# EAGLE design WeMos-WLED-V01-008 (EAGLE 9.5.1)
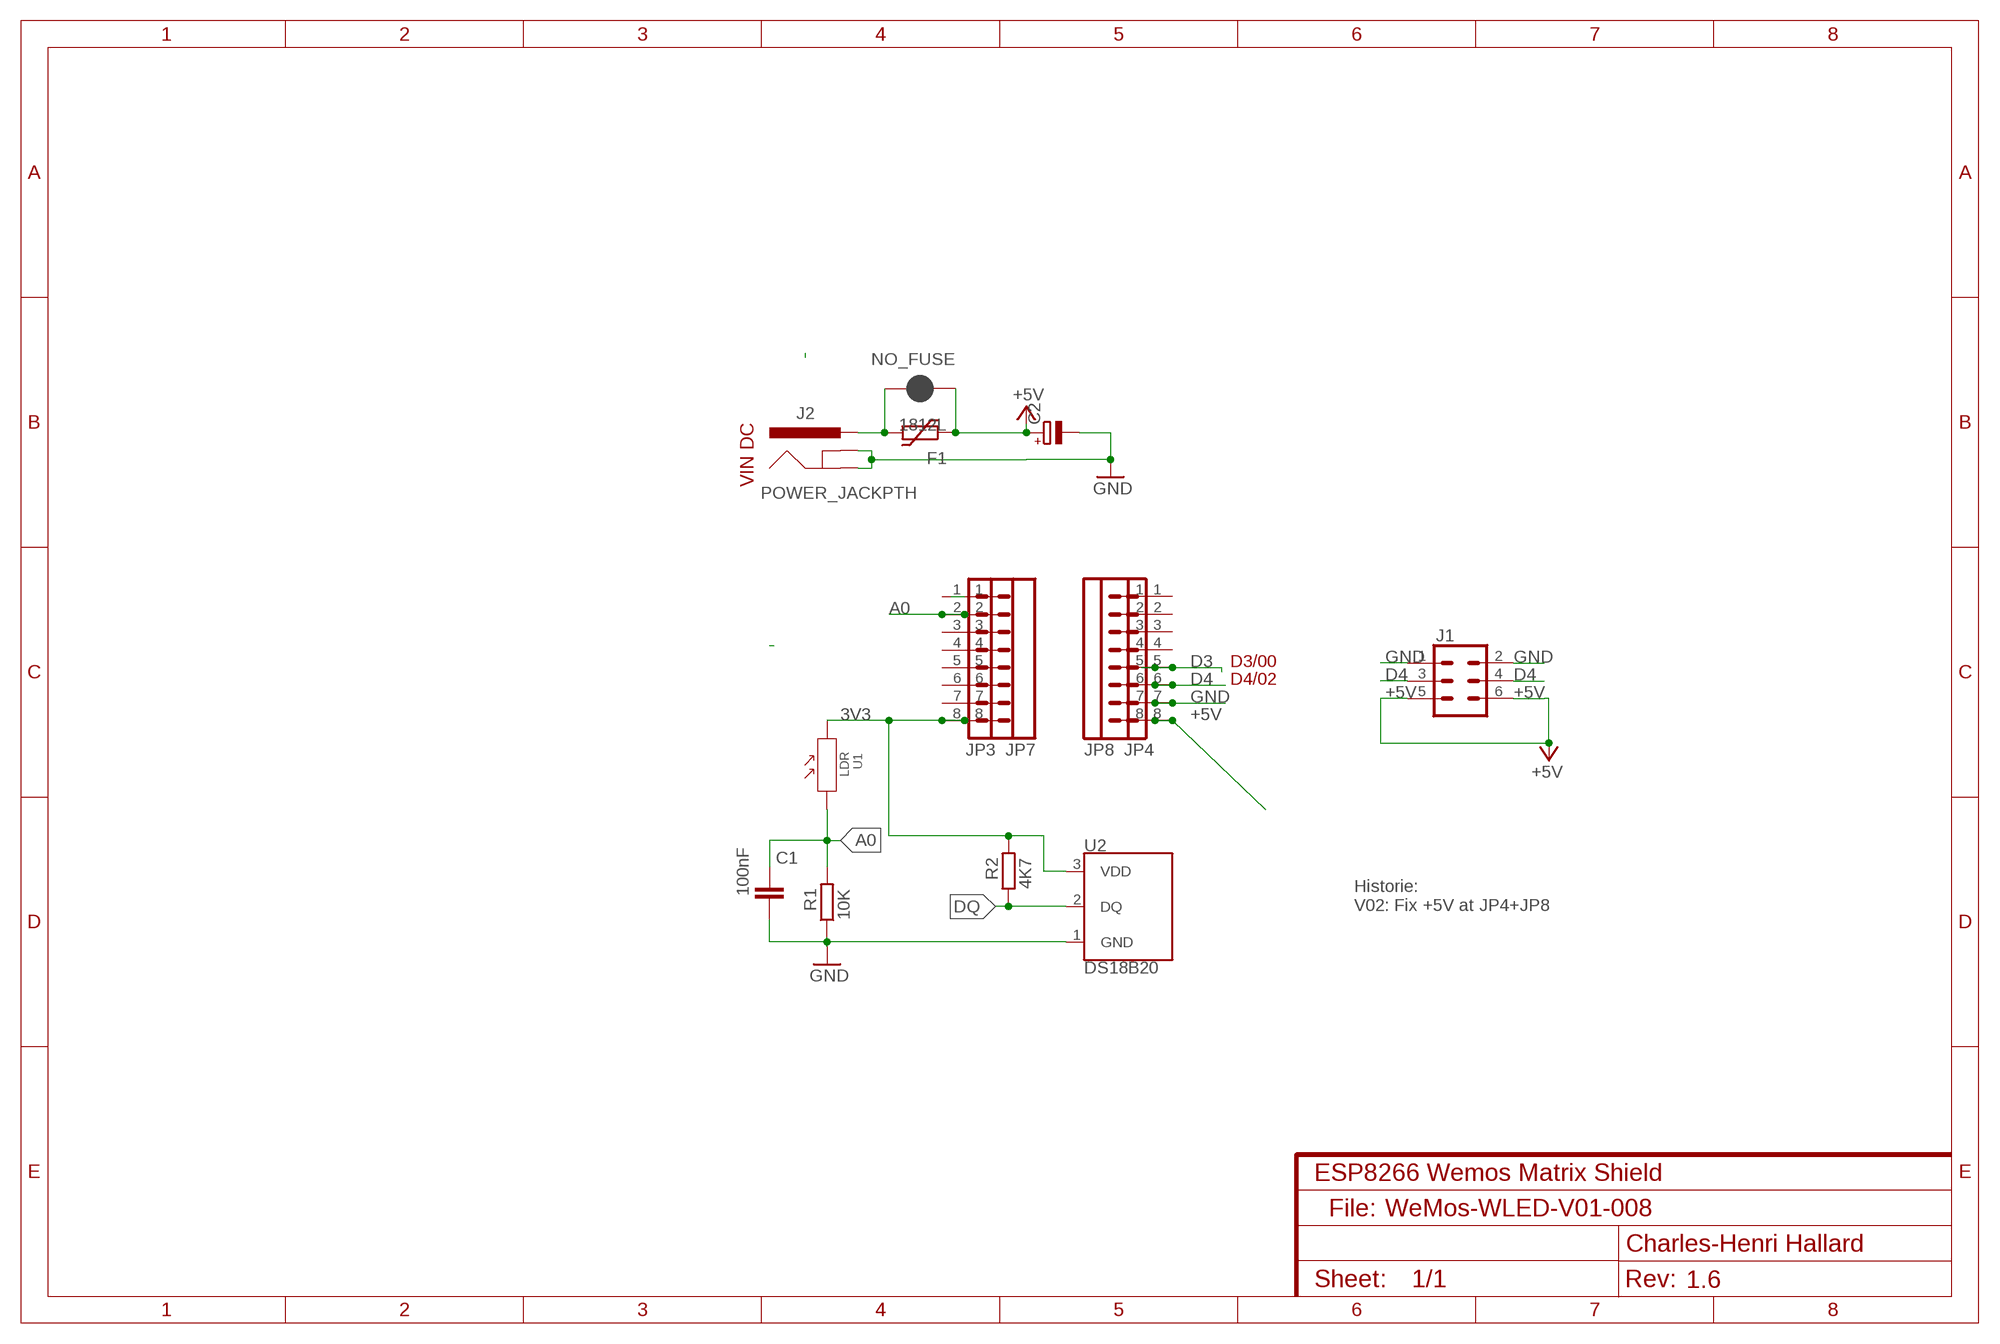
[diagram p0: schematic, sheet 1]
NAME (FRAME-A4L): CNAME: ESP8266 Wemos Matrix Shield; CREVISION: 1.6; DESIGNER: Charles-Henri Hallard

## Parts
C1  100nF  C-EUC0805  [C0805]
C2  CPOL-EUE2.5-7  [E2,5-7]
F1  1812L  [1812L]
J1  CONN_03X22X3_SILK_MALE_PTH  [2X3]
J2  POWER_JACKPTH  [POWER_JACK_PTH]
JP3  M08NO_SILK_FEMALE_PTH  [1X08_NO_SILK]
JP4  M08NO_SILK_FEMALE_PTH  [1X08_NO_SILK]
JP7  M08NO_SILK_FEMALE_PTH  [1X08_NO_SILK]
JP8  M08NO_SILK_FEMALE_PTH  [1X08_NO_SILK]
NO_FUSE  JUMPER-SMT_2_NC_PASTE_NO-SILK  [SMT-JUMPER_2_NC_PASTE_NO-SILK]
R1  10K  R-EU_R0805  [R0805]
R2  4K7  R-EU_R0805  [R0805]
U1  LDR  PHOTORESISTOR-5528-10K(2P-5.0X4.2MM)  [SNR2-3.0]
U2  DS18B20  [TO-92-AMMO]

## Nets
3V3: JP3.8 JP7.8 R2.2 U1.2 U2.3(VDD)
+5V [power]: C2.+ F1.P$1 J1.5 J1.6 JP4.8 JP8.8 NO_FUSE.1
A0: C1.1 JP3.2 JP7.2 R1.2 U1.1
D3: JP4.5 JP8.5
D4: J1.3 J1.4 JP4.6 JP8.6
DQ: R2.1 U2.2(DQ)
GND [power]: C1.2 C2.- J1.1 J1.2 J2.GND J2.GNDBREAK JP4.7 JP8.7 R1.1 U2.1(GND)
RST: JP7.1
VIN [power]: F1.P$2 J2.PWR NO_FUSE.2
Unconnected: JP3.1 JP3.3 JP3.4 JP3.5 JP3.6 JP3.7 JP4.1 JP4.2 JP4.3 JP4.4 JP7.3 JP7.4 JP7.5 JP7.6 JP7.7 JP8.1 JP8.2 JP8.3 JP8.4

## Notes on the sheet
- VIN DC
- D3/00
- D4/02
- Historie:
  V02: Fix +5V at JP4+JP8
- File:

## Library data of the parts
C1 = rcl:C-EU: CAPACITOR, European symbol; SPICEPREFIX: C
C2 = rcl:CPOL-EU: POLARIZED CAPACITOR, European symbol; SPICEPREFIX: C
F1 = ptc-littlefuse:1812L
J1 = SparkFun-Connectors:CONN_03X2: Multi connection point. Often used as Generic Header-pin footprint for 0.1 inch spaced/style header connections You can populate with any combo of single row headers, but if you'd like an exact match, check these: Header - 2x3 (Male, 0.1") <https://www.sparkfun.com/products/12807> (PRT-12807) Header - 2x3 (Female, 0.1") <https://www.sparkfun.com/products/13010> (PRT-13010) 2x3 Pin Shrouded Header <https://www.sparkfun.com/products/10877> (PRT-10877) On any of the 0.1 inch spaced packages, you can populate with these: Break Away Headers - Straight <https://www.sparkfun.com/products/116> (PRT-00116) Break Away Male Headers - Right Angle <https://www.sparkfun.com/products/553> (PRT-00553) Female Headers <https://www.sparkfun.com/products/115> (PRT-00115) Break Away Headers - Machine Pin <https://www.sparkfun.com/products/117> (PRT-00117) Break Away Female Headers - Swiss Machine Pin <https://www.sparkfun.com/products/743> (PRT-00743) Special note: the shrouded connector mates well with our 3x2 ribbon cables: Ribbon Crimp Connector - 6-pin (2x3, Female) <https://www.sparkfun.com/products/10651> (PRT-10651) Ribbon Cable - 6 wire (15ft) <https://www.sparkfun.com/products/10646> (PRT-10646); PROD_ID: CONN-09701
J2 = SparkFun-Connectors:POWER_JACK: Power Jack This is the standard 5.5mm barrel jack for power. The PTH is the most common, proven, reliable, footprint. The Slot footprint only works if the mill layer is transmitted to the PCB fab house so be warned. Spark Fun Electronics SKU : PRT-00119 SMT: CONN-08106 Mating wall wart : TOL-00298 (and others)
JP3 JP4 JP7 JP8 = SparkFun-Connectors:M08: Header 8 Standard 8-pin 0.1" header. Use with straight break away headers (SKU : PRT-00116), right angle break away headers (PRT-00553), swiss pins (PRT-00743), machine pins (PRT-00117), and female headers (PRT-00115).; PROD_ID: CONN-08438
NO_FUSE = SparkFun-Jumpers:JUMPER-SMT_2_NC_PASTE: Normally closed solder jumper This jumper has an aperture in the stencil to allow solder paste to bridge the split in the wire so it's normally closed (NC). Wick off the solder to open the connection. Reapply solder to reclose the connection.
R1 R2 = rcl:R-EU_: RESISTOR, European symbol; SPICEPREFIX: R
U1 = Seeed-Sensor:PHOTORESISTOR-5528-10K(2P-5.0X4.2MM): 314020017; MPN: PHOTORESISTOR-5528-10K; VALUE: PHOTORESISTOR-5528-10K
U2 = SparkFun-Sensors:DS18B20: Dallas/Maxim DS18B20 1-Wire Temperature Sensor The DS18B20 reports degrees C with 9 to 12-bit precision, -55C to 125C (+/-0.5C). Each sensor has a unique 64-Bit Serial number etched into it - allows for a huge number of sensors to be used on one data bus. Datasheet <http://datasheets.maximintegrated.com/en/ds/DS18B20.pdf> SparkFun Products One Wire Digital Temperature Sensor - DS18B20 <https://www.sparkfun.com/products/245> (SEN-00245); STORE_ID: SEN-00245

## Net classes
0 default: width 0.203 mm, drill 0.356 mm
1 power: width 0.914 mm

## Board
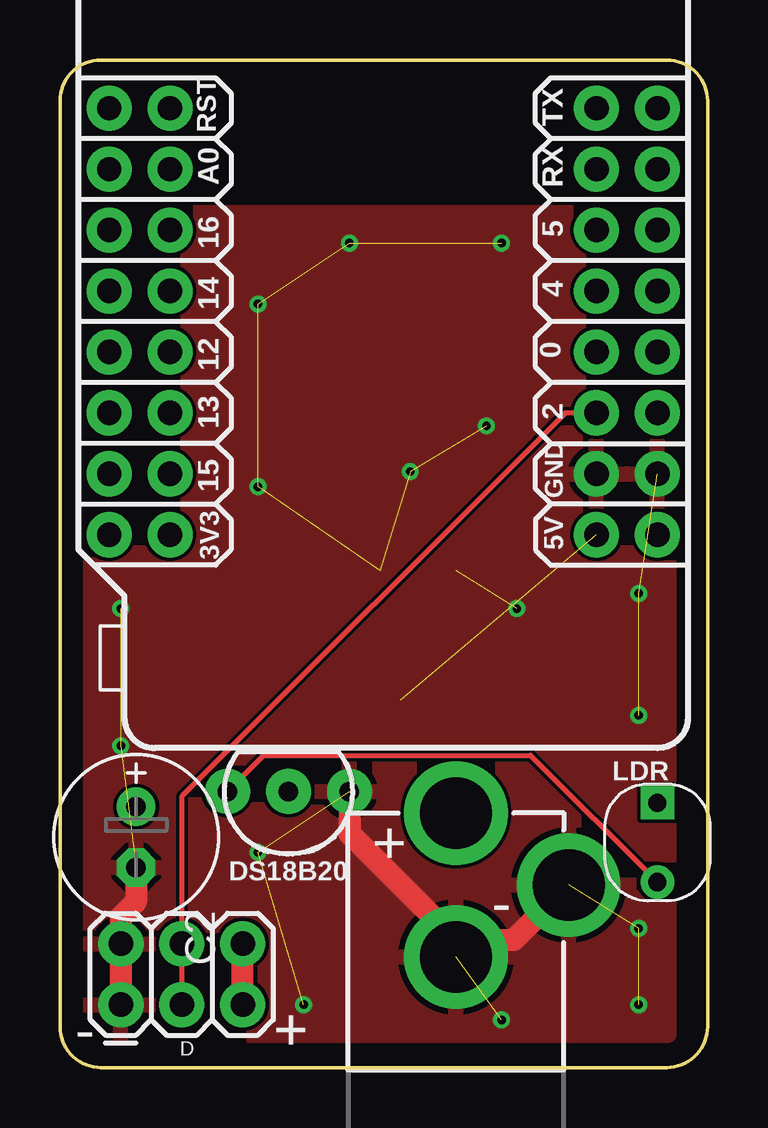
[diagram p1: board, top side]
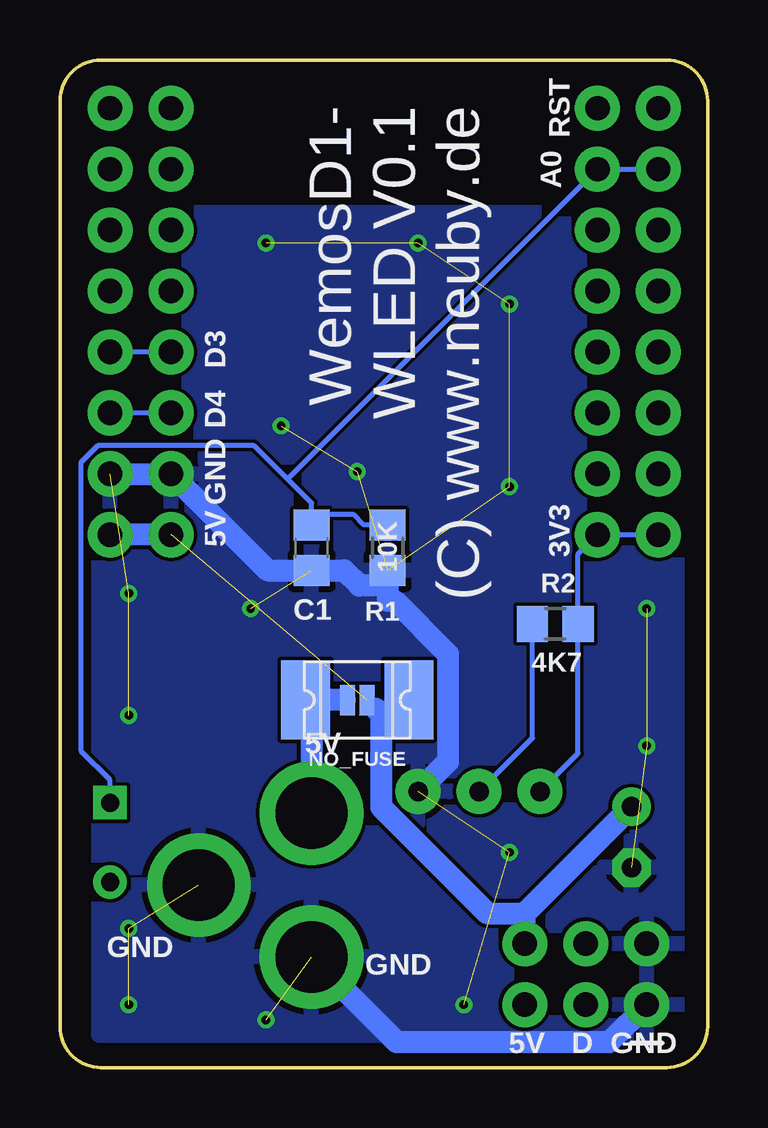
[diagram p2: board, bottom side, seen from below]

Size 27 x 42 mm. Coordinates in mm from the lower left corner, seen from the top.
Outline: 25.29,0 1.71,0 arc-90 0,1.71 0,40.29 arc-90 1.71,42 25.29,42 arc-90 27,40.29 27,1.71 arc-90 25.29,0
Copper layers (1*16): Top 0.0356mm / dielectric 1.5011mm / Bottom 0.0356mm
Design rules "PCBs_io *": minimum track width 6mil, minimum drill 13mil, track to track 6mil, track to pad 6mil, pad to pad 6mil, via to via 6mil, smd to smd 6mil, copper to edge 15mil, drill to drill 6mil, minimum pad ring 7mil, minimum via ring 7mil, stop-mask expansion 3mil, vias tented up to drill 40mil, thermal gap 10mil

### Footprints (pad centres in the part's own frame; a part is rotated, then mirrored left to right if it is on the bottom)
C0805 = smd 1.3 x 1.5: 1 -0.95,0; 2 0.95,0
E2,5-7 = drill 0.813 pad 1.6: + -1.27,0 | drill 0.813 pad 1.6 octagon: - 1.27,0
1812L = smd 2.03 x 3.3: P$1 -2.16,0; P$2 2.16,0
2X3 = drill 1.016 pad 1.88: 1 0,0; 2 0,2.54; 3 2.54,0; 4 2.54,2.54; 5 5.08,0; 6 5.08,2.54
POWER_JACK_PTH = drill 2.997 pad 4.318: GND 0,7.7; GNDBREAK 4.7,10.7; PWR 0,13.7
1X08_NO_SILK = drill 1.016 pad 1.88: 1 0,0; 2 2.54,0; 3 5.08,0; 4 7.62,0; 5 10.16,0; 6 12.7,0; 7 15.24,0; 8 17.78,0
SMT-JUMPER_2_NC_PASTE_NO-SILK = smd 0.635 x 1.27: 1 -0.406,0; 2 0.406,0
R0805 = smd 1.3 x 1.5: 1 -0.95,0; 2 0.95,0
SNR2-3.0 = drill 0.762 pad 1.397 square: 1 -1.651,0 | drill 0.762 pad 1.397: 2 1.651,0
TO-92-AMMO = drill 0.813 pad 1.88: 1 -2.54,0; 2 0,0; 3 2.54,0

### Placement (x,y rotation side)
C1  16.51,21.67 270 bottom
C2  3.17,9.61 270 top
F1  14.61,15.32 180 bottom
J1  2.54,2.62 0 top
J2  16.51,-3.09 0 top
JP3  2.05,39.99 270 bottom
JP4  24.91,39.99 270 bottom
JP7  4.59,39.99 270 bottom
JP8  22.37,39.99 270 bottom
NO_FUSE  14.61,15.32 180 bottom
R1  13.34,21.67 90 bottom
R2  6.35,18.5 0 bottom
U1  24.91,9.38 270 top
U2  9.53,11.51 180 top

### Tracks (layer width: path | path; a pad name or v marks a point on that pad's centre or on a via)
3V3
  Top 0.203: U2.3 8.49,13.02 19.62,13.02 U1.2
  Bottom 0.203: U2.3 5.4,13.09 R2.2 5.4,21.4 JP7.8 JP3.8
+5V  (1 unrouted)
  Top 0.914: J1.5 J1.6
  Bottom 0.635: 13.83,14.95 NO_FUSE.1
  Bottom 0.914: 13.62,14.74 13.83,14.95 | 13.62,14.74 13.62,10.87 9.18,6.43 7.62,6.43 | F1.P$1 13.03,14.74 13.62,14.74 | 7.62,6.43 C2.+ | J1.6 7.62,6.43 | JP8.8 JP4.8
A0
  Bottom 0.203: 17.51,24.53 16.51,23.52 16.51,23.07 | 17.51,24.53 18.93,25.95 25.41,25.95 26.11,25.25 26.11,13.18 24.91,11.99 U1.1 | 17.51,24.53 JP7.2 JP3.2 | R1.2 14.34,22.62 14.79,23.07 16.51,23.07 | C1.1 16.51,23.07
D3
  Bottom 0.203: JP8.5 JP4.5
D4
  Top 0.203: JP8.6 21.07,27.29 5.08,11.3 J1.4 J1.3
  Bottom 0.203: JP8.6 JP4.6
DQ
  Bottom 0.203: U2.2 7.3,13.73 R2.1
GND  (via drill 0.35)  (16 unrouted)
  Top 0.914: 16.51,5.31 18.92,5.31 J2.GNDBREAK | U2.1 12.06,9.76 16.51,5.31 | 16.51,5.31 J2.GND | J1.1 J1.2 2.54,6.29 3.17,6.93 C2.-
  Bottom 0.914: J2.GND 12.97,1.07 4.09,1.07 J1.1 | U2.1 10.82,12.76 10.82,17.22 13.06,19.46 13.34,19.46 13.34,20.09 | 13.34,20.09 14.52,20.09 15.15,20.72 C1.2 18.34,20.72 JP8.7 JP4.7 | R1.1 13.34,20.09
  other vias: 10.16,2.62 24.13,2.62 24.13,5.79 24.13,19.77 18.41,34.37 8.26,31.83 12.06,34.37 8.26,24.21 2.54,19.13 2.54,13.41 17.78,26.75 14.61,24.84 19.05,19.13 24.13,14.68 8.26,8.97 18.41,1.99
  pour Bottom: 1.27,1.35 1.27,35.64 25.4,35.64 25.4,1.35
  pour Top: 25.4,35.64 1.27,35.64 1.27,1.35 25.4,1.35
VIN
  Bottom 0.635: 15.13,15.32 NO_FUSE.2
  Bottom 0.914: 16.51,15.32 F1.P$2 | 15.13,15.32 16.51,15.32 | 16.51,15.32 J2.PWR

### Text on the board
tNames: RST | TX | A0 | RX | 5 | 16 | 14 | 4 | 0 | 12 | 13 | 2 | 15 | GND | 5V | 3V3 | + | - | - | D | +
bNames: RST | WemosD1- / WLED V0.1 / (C) www.neuby.de | A0 | D3 | D4 | GND | 3V3 | 5V | 5V | GND | GND | GND | D | 5V